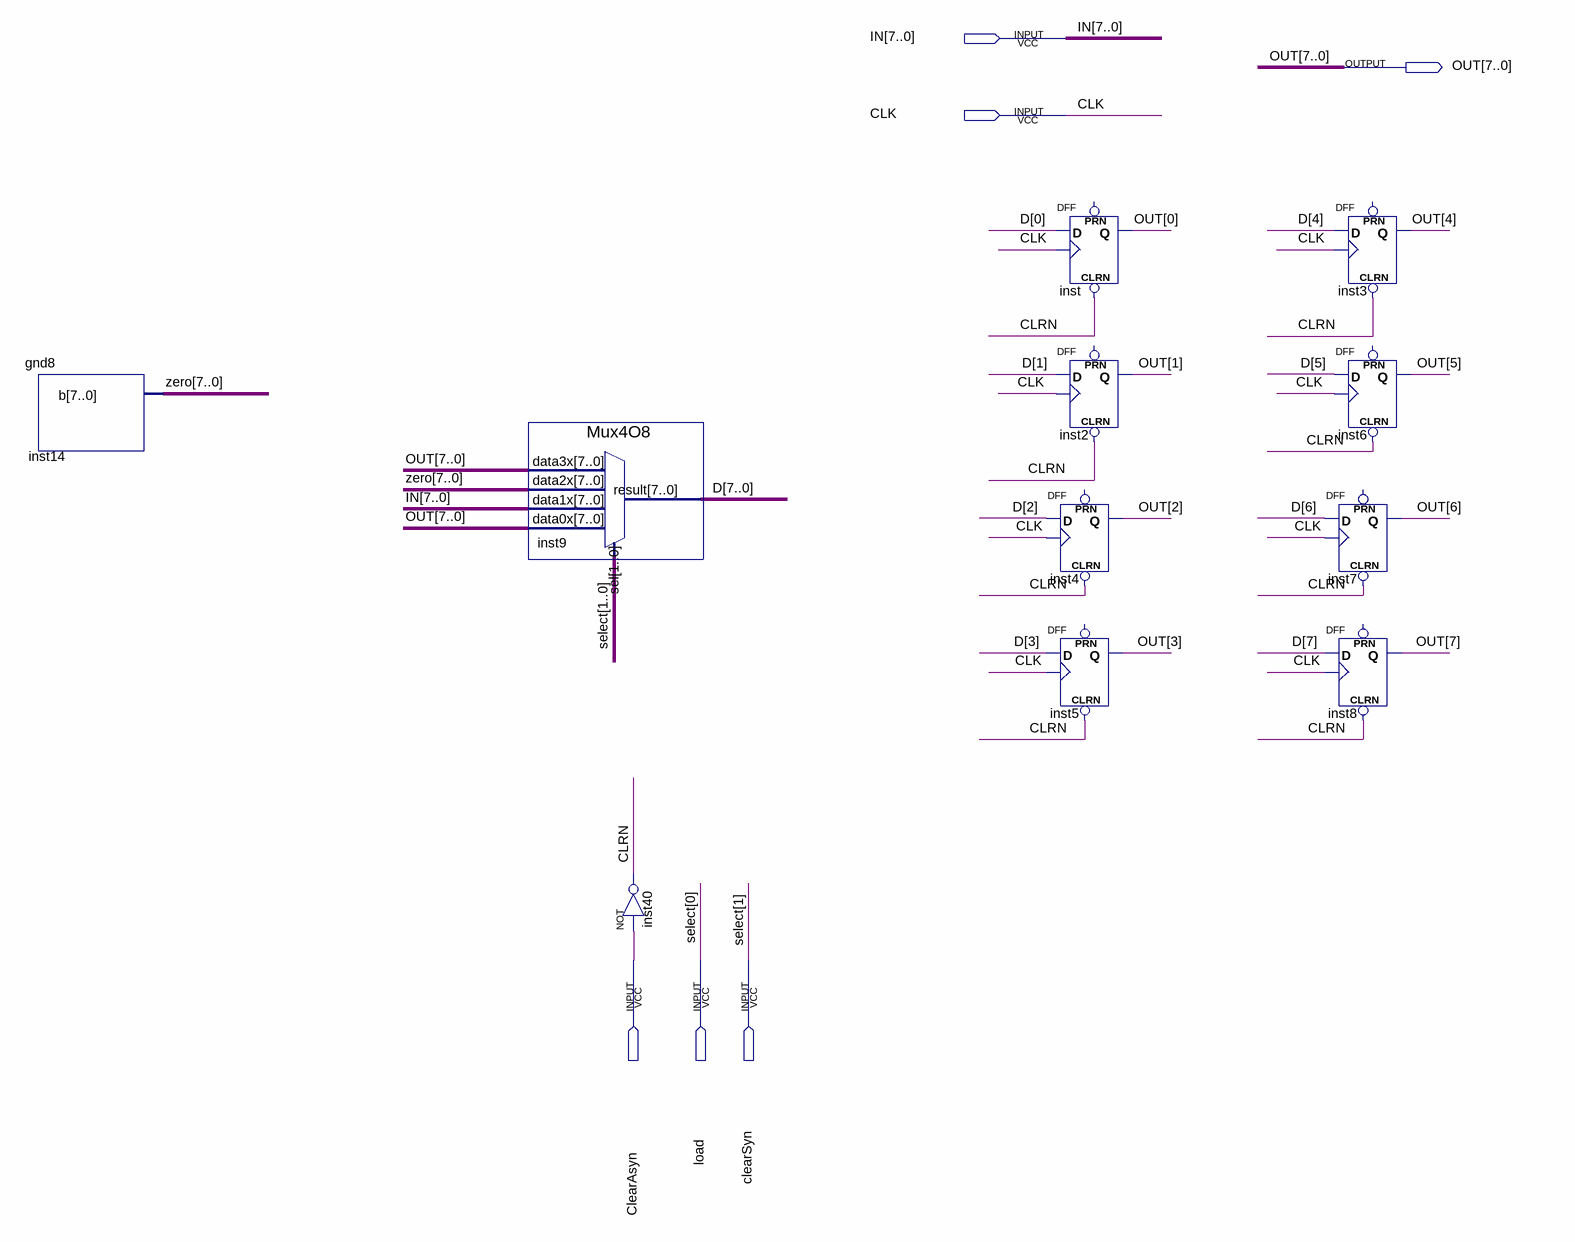
[diagram p0: schematic sheet]
// Quartus schematic Register8.bdf as structural Verilog: 11 symbols, 6 pins
module Register8 (
  input  [7:0] IN,
  input  CLK,
  input  ClearAsyn,
  input  load,
  input  clearSyn,
  output [7:0] OUT
);

  wire CLRN;
  wire [7:0] D, zero;

  gnd8 inst14 (.b(zero));
  Mux4O8 inst9 (.data3x(OUT), .data2x(zero), .data1x(IN), .data0x(OUT), .sel({clearSyn, load}), .result(D));
  not inst40 (CLRN, ClearAsyn);
  DFF inst (.CLRN(CLRN), .CLK(CLK), .D(D[0]), .Q(OUT[0]));  // open: PRN
  DFF inst2 (.CLRN(CLRN), .CLK(CLK), .D(D[1]), .Q(OUT[1]));  // open: PRN
  DFF inst4 (.CLRN(CLRN), .CLK(CLK), .D(D[2]), .Q(OUT[2]));  // open: PRN
  DFF inst5 (.CLRN(CLRN), .CLK(CLK), .D(D[3]), .Q(OUT[3]));  // open: PRN
  DFF inst3 (.CLRN(CLRN), .CLK(CLK), .D(D[4]), .Q(OUT[4]));  // open: PRN
  DFF inst6 (.CLRN(CLRN), .CLK(CLK), .D(D[5]), .Q(OUT[5]));  // open: PRN
  DFF inst7 (.CLRN(CLRN), .CLK(CLK), .D(D[6]), .Q(OUT[6]));  // open: PRN
  DFF inst8 (.CLRN(CLRN), .CLK(CLK), .D(D[7]), .Q(OUT[7]));  // open: PRN

  // Other names for the same wires on the sheet: select[1:0] = {clearSyn, load}
endmodule
